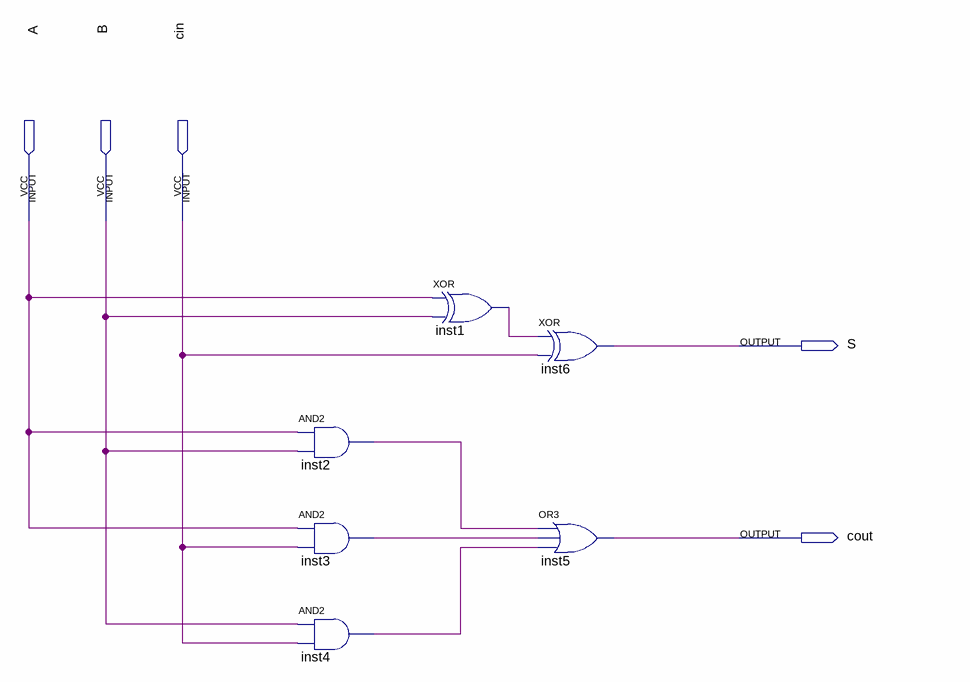
[diagram p0: schematic sheet]
// Quartus schematic FullAdder.bdf as structural Verilog: 6 symbols, 5 pins
module FullAdder (
  input  A,
  input  B,
  input  cin,
  output S,
  output cout
);

  wire inst1_out, inst2_out, inst3_out, inst4_out;

  and inst2 (inst2_out, A, B);
  and inst3 (inst3_out, A, cin);
  and inst4 (inst4_out, B, cin);
  xor inst1 (inst1_out, A, B);
  xor inst6 (S, inst1_out, cin);
  or inst5 (cout, inst2_out, inst3_out, inst4_out);
endmodule
